# Altium schematic sheet cyberlamp.SchDoc
size A3; SheetNumber: 2; SheetTotal: 5
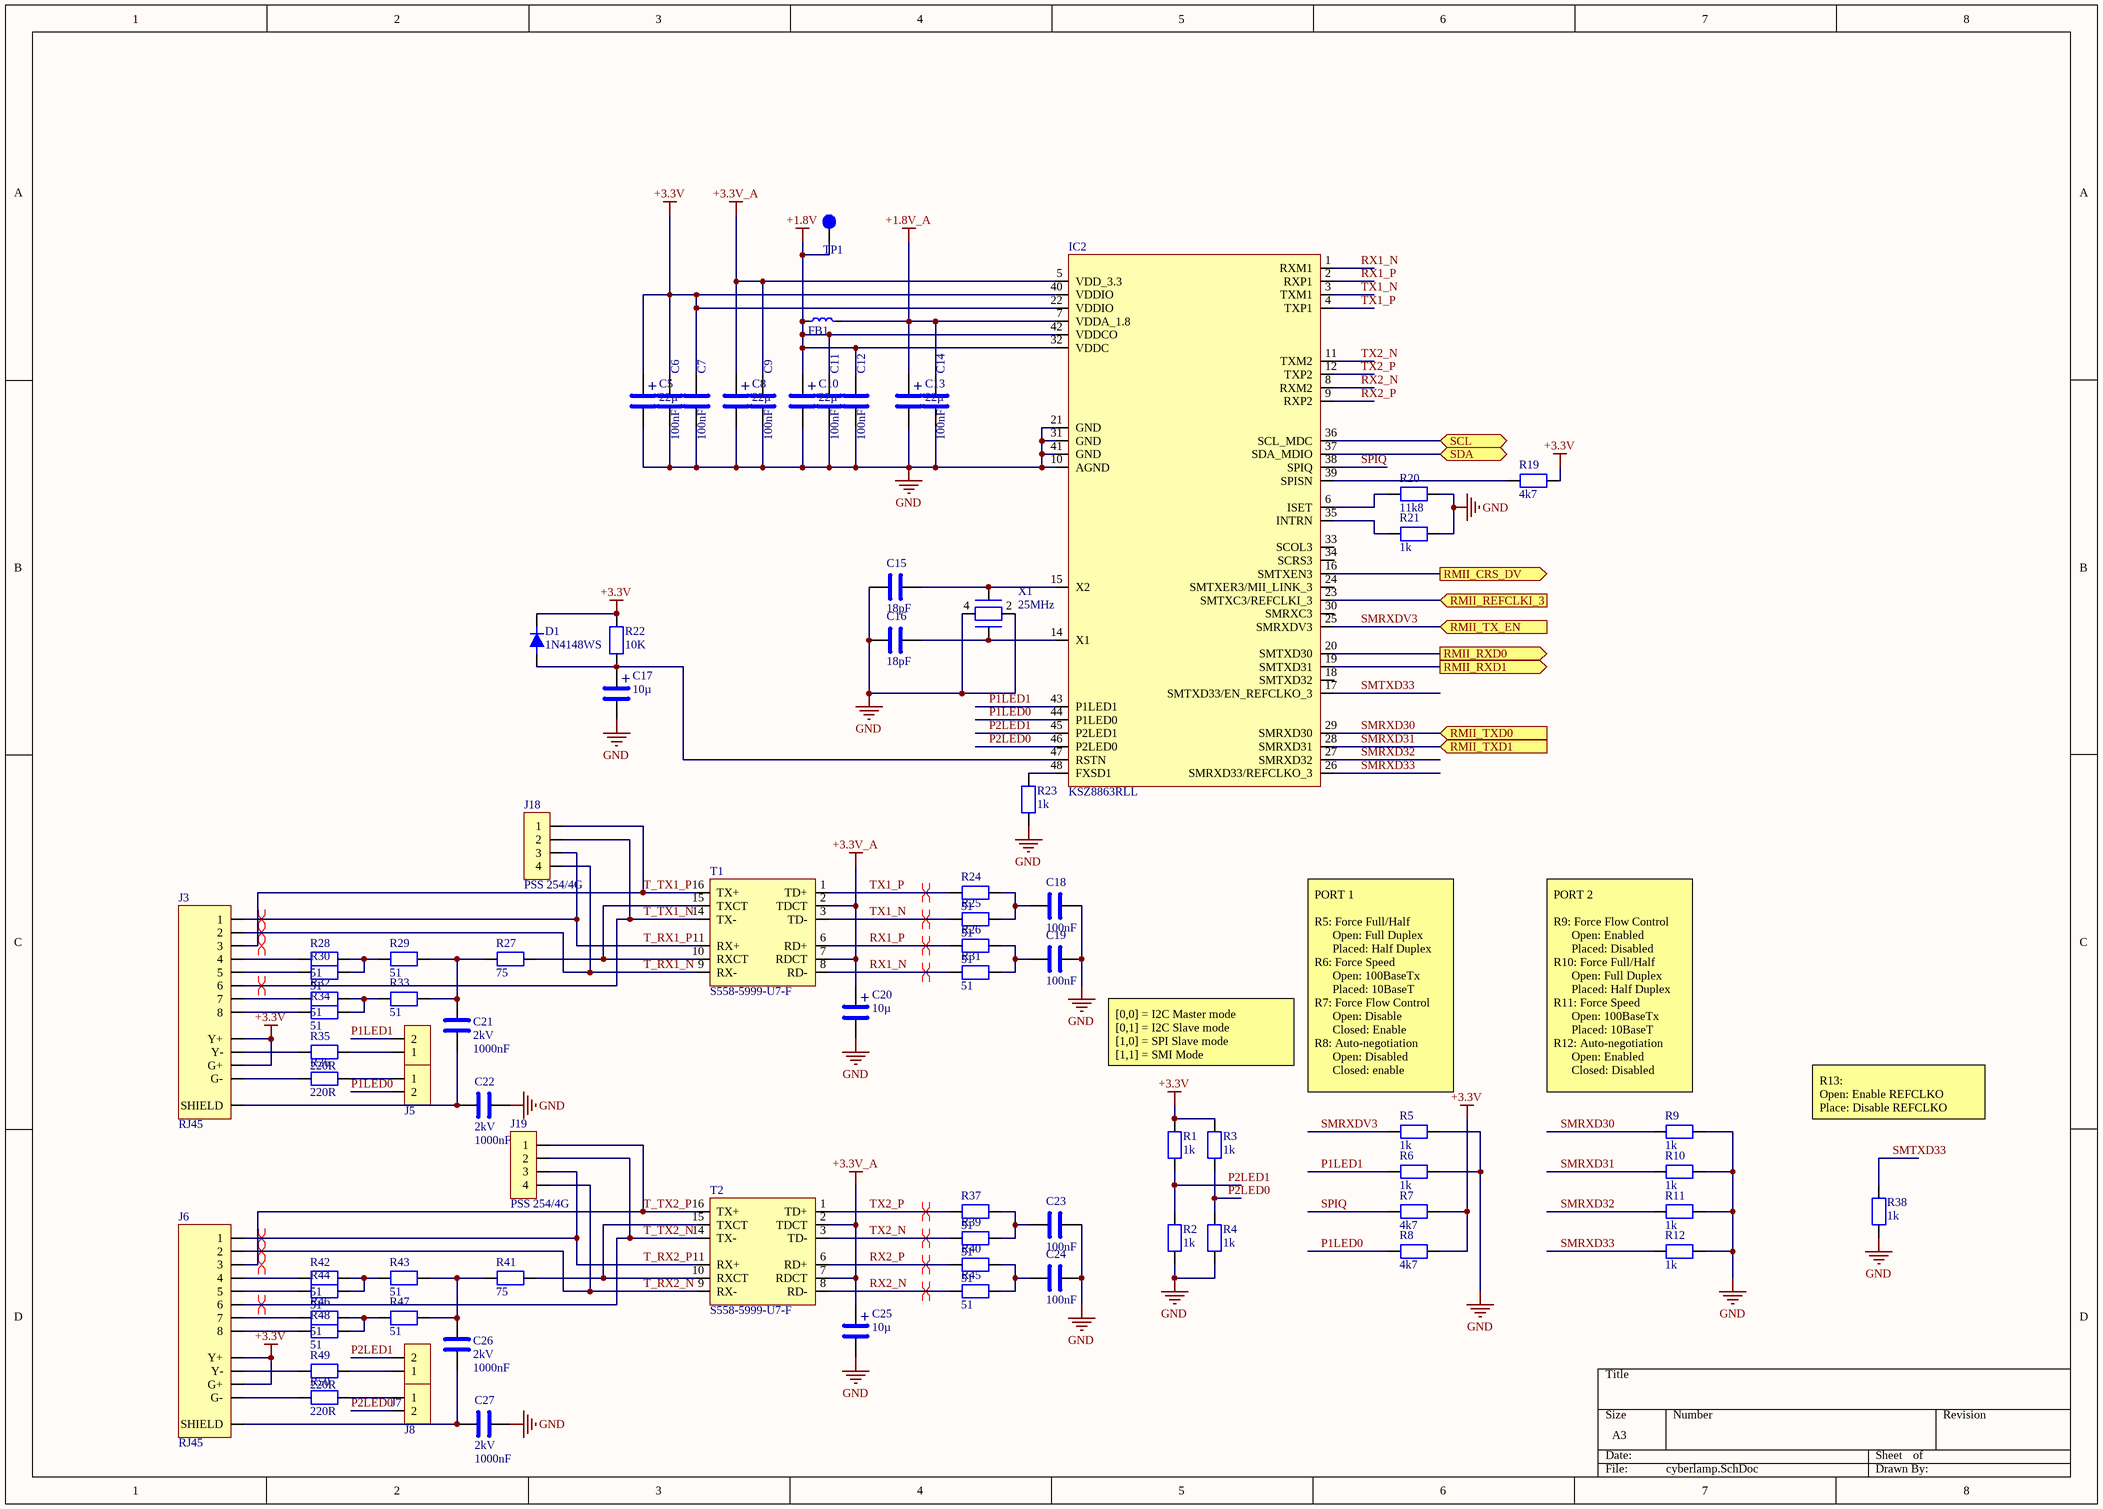
[diagram p0: cyberlamp.SchDoc]

## Parts
C5  value 22µ  [WCAP-ASLU]  (hidden comment: Elko 22µF 6.3V WE)
C6  value 100nF  [0603]  (hidden comment: 100nF 50V MLCC 0603)
C7  value 100nF  [0603]  (hidden comment: 100nF 50V MLCC 0603)
C8  value 22µ  [WCAP-ASLU]  (hidden comment: Elko 22µF 6.3V WE)
C9  value 100nF  [0603]  (hidden comment: 100nF 50V MLCC 0603)
C10  value 22µ  [WCAP-ASLU]  (hidden comment: Elko 22µF 6.3V WE)
C11  value 100nF  [0603]  (hidden comment: 100nF 50V MLCC 0603)
C12  value 100nF  [0603]  (hidden comment: 100nF 50V MLCC 0603)
C13  value 22µ  [WCAP-ASLU]  (hidden comment: Elko 22µF 6.3V WE)
C14  value 100nF  [0603]  (hidden comment: 100nF 50V MLCC 0603)
C15  value 18pF  [0603]  (hidden comment: 18pF 50V MLCC 0603)
C16  value 18pF  [0603]  (hidden comment: 18pF 50V MLCC 0603)
C17  value 10µ  [Panasonic_b]  (hidden comment: Elko_10uF_16V_PanasonicB)
C18  value 100nF  [0603]  (hidden comment: 100nF 50V MLCC 0603)
C19  value 100nF  [0603]  (hidden comment: 100nF 50V MLCC 0603)
C20  value 10µ  [Panasonic_b]  (hidden comment: Elko_10uF_16V_PanasonicB)
C21  value 1000nF  voltage: 2kV  [1206]  (hidden comment: NP0)
C22  value 1000nF  voltage: 2kV  [1206]  (hidden comment: NP0)
C23  value 100nF  [0603]  (hidden comment: 100nF 50V MLCC 0603)
C24  value 100nF  [0603]  (hidden comment: 100nF 50V MLCC 0603)
C25  value 10µ  [Panasonic_b]  (hidden comment: Elko_10uF_16V_PanasonicB)
C26  value 1000nF  voltage: 2kV  [1206]  (hidden comment: NP0)
C27  value 1000nF  voltage: 2kV  [1206]  (hidden comment: NP0)
D1  1N4148WS  [SOD323]
FB1  HI1206N101R-10  [1206]  (value not drawn)
IC2  KSZ8863RLL  [LQFP48]
J3  RJ45  [MTJ-88ARX1-FSM-PG-LH]
J4  SL 1X2G 2,54  [SL_1x2 2.54mm]  (value not drawn)
J5  SL 1X2G 2,54  [SL_1x2 2.54mm]  (value not drawn)
J6  RJ45  [MTJ-88ARX1-FSM-PG-LH]
J7  SL 1X2G 2,54  [SL_1x2 2.54mm]  (value not drawn)
J8  SL 1X2G 2,54  [SL_1x2 2.54mm]  (value not drawn)
J18  PSS 254/4G  [PSS 4pol]
J19  PSS 254/4G  [PSS 4pol]
R1  value 1k  [res0603]  (hidden comment: 1k 100mW 0603)
R2  value 1k  [res0603]  (hidden comment: 1k 100mW 0603)
R3  value 1k  [res0603]  (hidden comment: 1k 100mW 0603)
R4  value 1k  [res0603]  (hidden comment: 1k 100mW 0603)
R5  value 1k  [res0603]  (hidden comment: 1k 100mW 0603)
R6  value 1k  [res0603]  (hidden comment: 1k 100mW 0603)
R7  value 4k7  [res0603]  (hidden comment: 4k7 100mW 0603)
R8  value 4k7  [res0603]  (hidden comment: 4k7 100mW 0603)
R9  value 1k  [res0603]  (hidden comment: 1k 100mW 0603)
R10  value 1k  [res0603]  (hidden comment: 1k 100mW 0603)
R11  value 1k  [res0603]  (hidden comment: 1k 100mW 0603)
R12  value 1k  [res0603]  (hidden comment: 1k 100mW 0603)
R19  value 4k7  [res0603]  (hidden comment: 4k7 100mW 0603)
R20  value 11k8  [res0603]  (hidden comment: 11k8 100mW 0603)
R21  value 1k  [res0603]  (hidden comment: 1k 100mW 0603)
R22  value 10K  [res0603]  (hidden comment: 10K 100mW 0603)
R23  value 1k  [res0603]  (hidden comment: 1k 100mW 0603)
R24  value 51  [res0603]  (hidden comment: 51R 100mW 0603)
R25  value 51  [res0603]  (hidden comment: 51R 100mW 0603)
R26  value 51  [res0603]  (hidden comment: 51R 100mW 0603)
R27  value 75  [res0603]  (hidden comment: 75R 100mW 0603)
R28  value 51  [res0603]  (hidden comment: 51R 100mW 0603)
R29  value 51  [res0603]  (hidden comment: 51R 100mW 0603)
R30  value 51  [res0603]  (hidden comment: 51R 100mW 0603)
R31  value 51  [res0603]  (hidden comment: 51R 100mW 0603)
R32  value 51  [res0603]  (hidden comment: 51R 100mW 0603)
R33  value 51  [res0603]  (hidden comment: 51R 100mW 0603)
R34  value 51  [res0603]  (hidden comment: 51R 100mW 0603)
R35  value 220R  [res0603]  (hidden comment: 220R 100mW 0603)
R36  value 220R  [res0603]  (hidden comment: 220R 100mW 0603)
R37  value 51  [res0603]  (hidden comment: 51R 100mW 0603)
R38  value 1k  [res0603]  (hidden comment: 1k 100mW 0603)
R39  value 51  [res0603]  (hidden comment: 51R 100mW 0603)
R40  value 51  [res0603]  (hidden comment: 51R 100mW 0603)
R41  value 75  [res0603]  (hidden comment: 75R 100mW 0603)
R42  value 51  [res0603]  (hidden comment: 51R 100mW 0603)
R43  value 51  [res0603]  (hidden comment: 51R 100mW 0603)
R44  value 51  [res0603]  (hidden comment: 51R 100mW 0603)
R45  value 51  [res0603]  (hidden comment: 51R 100mW 0603)
R46  value 51  [res0603]  (hidden comment: 51R 100mW 0603)
R47  value 51  [res0603]  (hidden comment: 51R 100mW 0603)
R48  value 51  [res0603]  (hidden comment: 51R 100mW 0603)
R49  value 220R  [res0603]  (hidden comment: 220R 100mW 0603)
R50  value 220R  [res0603]  (hidden comment: 220R 100mW 0603)
T1  S558-5999-U7-F  [S558-5999-U7-F]
T2  S558-5999-U7-F  [S558-5999-U7-F]
TP1  testpoint  [testpoint]  (value not drawn)
X1  25MHz  [ABM8]

## Ports
RMII_CRS_DV (out), RMII_REFCLKI_3 (in), RMII_RXD0 (out), RMII_RXD1 (out), RMII_TX_EN (in), RMII_TXD0 (in), RMII_TXD1 (in), SCL (bidir), SDA (bidir)

## Nets
+1.8V: C10.+ C11.1 C12.1 FB1.1 IC2.32(VDDC) IC2.42(VDDCO) TP1.1
+1.8V_A: C13.+ C14.1 FB1.2 IC2.7(VDDA_1.8)
+3.3V: C5.+ C6.1 C7.1 D1.1 IC2.22(VDDIO) IC2.40(VDDIO) J3.10(Y+) J3.12(G+) J6.10(Y+) J6.12(G+) R1.2 R3.2 R7.1 R8.1 R19.1 R22.2
+3.3V_A: C8.+ C9.1 C20.+ C25.+ IC2.5(VDD_3.3) T1.2(TDCT) T1.7(RDCT) T2.2(TDCT) T2.7(RDCT)
GND: C5.- C6.2 C7.2 C8.- C9.2 C10.- C11.2 C12.2 C13.- C14.2 C15.1 C16.1 C17.- C18.2 C19.2 C20.- C22.1 C23.2 C24.2 C25.- C27.1 IC2.10(AGND) IC2.21(GND) IC2.31(GND) IC2.41(GND) R2.1 R4.1 R5.1 R6.1 R9.1 R10.1 R11.1 R12.1 R20.1 R21.1 R23.2 R38.2 X1.2 X1.4
P1LED0: IC2.44(P1LED0) J5.2 R8.2
P1LED1: IC2.43(P1LED1) J4.2 R6.2
P2LED0: IC2.46(P2LED0) J8.2 R3.1 R4.2
P2LED1: IC2.45(P2LED1) J7.2 R1.1 R2.2
RMII_CRS_DV: IC2.16(SMTXEN3) ; port RMII_CRS_DV
RMII_REFCLKI_3: IC2.23(SMTXC3/REFCLKI_3) ; port RMII_REFCLKI_3
RMII_RXD0: IC2.20(SMTXD30) ; port RMII_RXD0
RMII_RXD1: IC2.19(SMTXD31) ; port RMII_RXD1
RX1_N: IC2.1(RXM1) R31.2 T1.8(RD-)
RX1_P: IC2.2(RXP1) R26.2 T1.6(RD+)
RX2_N: IC2.8(RXM2) R45.2 T2.8(RD-)
RX2_P: IC2.9(RXP2) R40.2 T2.6(RD+)
SCL: IC2.36(SCL_MDC) ; port SCL
SDA: IC2.37(SDA_MDIO) ; port SDA
SMRXD30: IC2.29(SMRXD30) R9.2 ; port RMII_TXD0
SMRXD31: IC2.28(SMRXD31) R10.2 ; port RMII_TXD1
SMRXD32: IC2.27(SMRXD32) R11.2
SMRXD33: IC2.26(SMRXD33/REFCLKO_3) R12.2
SMRXDV3: IC2.25(SMRXDV3) R5.2 ; port RMII_TX_EN
SMTXD33: IC2.17(SMTXD33/EN_REFCLKO_3) R38.1
SPIQ: IC2.38(SPIQ) R7.2
T_RX1_N: J3.2 J18.4 T1.9(RX-)
T_RX1_P: J3.1 J18.3 T1.11(RX+)
T_RX2_N: J6.2 J19.4 T2.9(RX-)
T_RX2_P: J6.1 J19.3 T2.11(RX+)
T_TX1_N: J3.6 J18.2 T1.14(TX-)
T_TX1_P: J3.3 J18.1 T1.16(TX+)
T_TX2_N: J6.6 J19.2 T2.14(TX-)
T_TX2_P: J6.3 J19.1 T2.16(TX+)
TX1_N: IC2.3(TXM1) R25.2 T1.3(TD-)
TX1_P: IC2.4(TXP1) R24.2 T1.1(TD+)
TX2_N: IC2.11(TXM2) R39.2 T2.3(TD-)
TX2_P: IC2.12(TXP2) R37.2 T2.1(TD+)
NetC15_2: C15.2 IC2.15(X2) X1.1
NetC16_2: C16.2 IC2.14(X1) X1.3
NetC17_+: C17.+ D1.2 IC2.47(RSTN) R22.1
NetC18_1: C18.1 R24.1 R25.1
NetC19_1: C19.1 R26.1 R31.1
NetC21_1: C21.1 C22.2 J3.13(SHIELD)
NetC21_2: C21.2 R27.2 R29.1 R33.1
NetC23_1: C23.1 R37.1 R39.1
NetC24_1: C24.1 R40.1 R45.1
NetC26_1: C26.1 C27.2 J6.13(SHIELD)
NetC26_2: C26.2 R41.2 R43.1 R47.1
NetIC2_6: IC2.6(ISET) R20.2
NetIC2_35: IC2.35(INTRN) R21.2
NetIC2_39: IC2.39(SPISN) R19.2
NetIC2_48: IC2.48(FXSD1) R23.1
NetJ3_4: J3.4 R28.2
NetJ3_5: J3.5 R30.2
NetJ3_7: J3.7 R32.2
NetJ3_8: J3.8 R34.2
NetJ3_9: J3.9(Y-) R35.2
NetJ3_11: J3.11(G-) R36.2
NetJ4_1: J4.1 R35.1
NetJ5_1: J5.1 R36.1
NetJ6_4: J6.4 R42.2
NetJ6_5: J6.5 R44.2
NetJ6_7: J6.7 R46.2
NetJ6_8: J6.8 R48.2
NetJ6_9: J6.9(Y-) R49.2
NetJ6_11: J6.11(G-) R50.2
NetJ7_1: J7.1 R49.1
NetJ8_1: J8.1 R50.1
NetR27_1: R27.1 T1.10(RXCT) T1.15(TXCT)
NetR28_1: R28.1 R29.2 R30.1
NetR32_1: R32.1 R33.2 R34.1
NetR41_1: R41.1 T2.10(RXCT) T2.15(TXCT)
NetR42_1: R42.1 R43.2 R44.1
NetR46_1: R46.1 R47.2 R48.1

Not connected (* = marked no-connect by the designer): IC2 18(SMTXD32) 24(SMTXER3/MII_LINK_3) 30(SMRXC3) 33(SCOL3) 34(SCRS3)

## Layout directives
differential pair: RX1_N, RX1_P, RX2_N, RX2_P, T_RX1_N, T_RX1_P, T_RX2_N, T_RX2_P, T_TX1_N, T_TX1_P, T_TX2_N, T_TX2_P, TX1_N, TX1_P, TX2_N, TX2_P

## Notes on the sheet
- [0,0] = I2C Master mode
  [0,1] = I2C Slave mode
  [1,0] = SPI Slave mode
  [1,1] = SMI Mode
- (near R5) PORT 1
  R5: Force Full/Half
  Open: Full Duplex
  Placed: Half Duplex
  R6: Force Speed
  Open: 100BaseTx
  Placed: 10BaseT
  R7: Force Flow Control
  Open: Disable
  Closed: Enable
  R8: Auto-negotiation
  Open: Disabled
  Closed: enable
- (near R9) PORT 2
  R9: Force Flow Control
  Open: Enabled
  Placed: Disabled
  R10: Force Full/Half
  Open: Full Duplex
  Placed: Half Duplex
  R11: Force Speed
  Open: 100BaseTx
  Placed: 10BaseT
  R12: Auto-negotiation
  Open: Enabled
  Closed: Disabled
- R13:
  Open: Enable REFCLKO
  Place: Disable REFCLKO

## Library data of the parts
C6 C7 C9 C11 C12 C14 C18 C19 C23 C24 = 100nF 50V MLCC 0603: Reichelt code: X7R-G0603 100N; dielectricum: X7R; voltage: 50V; mouser code: 80-C0603X104K3R; storage: AIDTEKBox | Röhrchen; storageID: 18 | F7; lcsc code: C2252264
C15 C16 = 18pF 50V MLCC 0603: dielectricum: C0G; mouser code: 603-CC0603JRNPABN180; voltage: 50V; storageID: 179
C17 C20 C25 = Elko_10uF_16V_PanasonicB: voltage: 16V; mouser code: EEEHB1C100R
C21 C22 C26 C27 = 1000nF 2kV X7R 1206: mouser code: 710-885342208024
D1 = 1N4148WS: Small signal diode; mouser code: 512-1N4148WS; storage: AIDETEK; storageID: 189
FB1 = HI1206N101R-10: 3A ferrit bead; mouser code: 875-HI1206N101R-10; storage: AIDETEK; storageIDE: 188
IC2 = KSZ8863RLL: Dual port ethernet switch with RMII; mouser code: 998-KSZ8863RLL
J3 J6 = MTJ-88ARX1-FSM-PG-LH: RJ45, shielded with LED; mouser code: 737-MTJ88ARX1FSMPGLH
J4 J5 J7 J8 = SL 1X2G 2,54: Stiftleiste 2pol 2.54mm; reichelt code: SL 1X50G 2,54
J18 J19 = PSS 254/4G: PSS 4pol wire-to-board-connector; reichelt code: PSS 254/4G
R1-R6 R9-R12 R21 R23 R38 = 1k 100mW 0603: Tolerance: 1%; Reichelt code: SMD-0603 1K; Power rating: 100mW; storage: Röhrchen; storageID: B1
R20 = 11k8 100mW 0603: Tolerance: 1%; mouser code: 603-RT0603DRE0711K8L; Power rating: 100mW; storage: AIDTEKBox; storageID: 177
R22 = 10K 100mW 0603: Tolerance: 1%; Reichelt code: SMD-0603 10K; Power rating: 100mW; mouser code: 603-RE0603FRE0710KL; storage: AIDTEKBox; storageID: 4
R24-R26 R28-R34 R37 R39 R40 R42-R48 = 51R 100mW 0603: 51 100mW 0603; Tolerance: 5%; AIDTEKBox: 176; mouser code: 791-WR06X510JTR; Power rating: 100mW; storage: AIDETEK; storageID: 176
R27 R41 = 75R 100mW 0603: 75 100mW 0603; Tolerance: 1%; mouser code: 603-RC0603FR-7W75RL; Power rating: 100mW
R35 R36 R49 R50 = 220R 100mW 0603: Tolerance: 1%; Power rating: 100mW; storage: Röhrchen; storageID: I8
T1 T2 = S558-5999-U7-F: Ethernet transformer; mouser code: 530-S558-5999-U7-F
X1 = ABM8-25.000MHZ-B2-T: ABM8 25MHz crystal; mouser code: 815-ABM8-25-B2-T; storage: AIDETEK; storageID: 187
C5 C8 C10 C13 = Elko 22µF 6.3V WE: voltage: 6.3V; mouser code: 710-865090168010
R7 R8 R19 = 4k7 100mW 0603: mouser code: 603-RE0603FRE074K7L; Power rating: 100mW; storage: AIDTEKBox; storageID: 5